# Altium project SPT3G_LCBoard_Rev3.PrjPcb
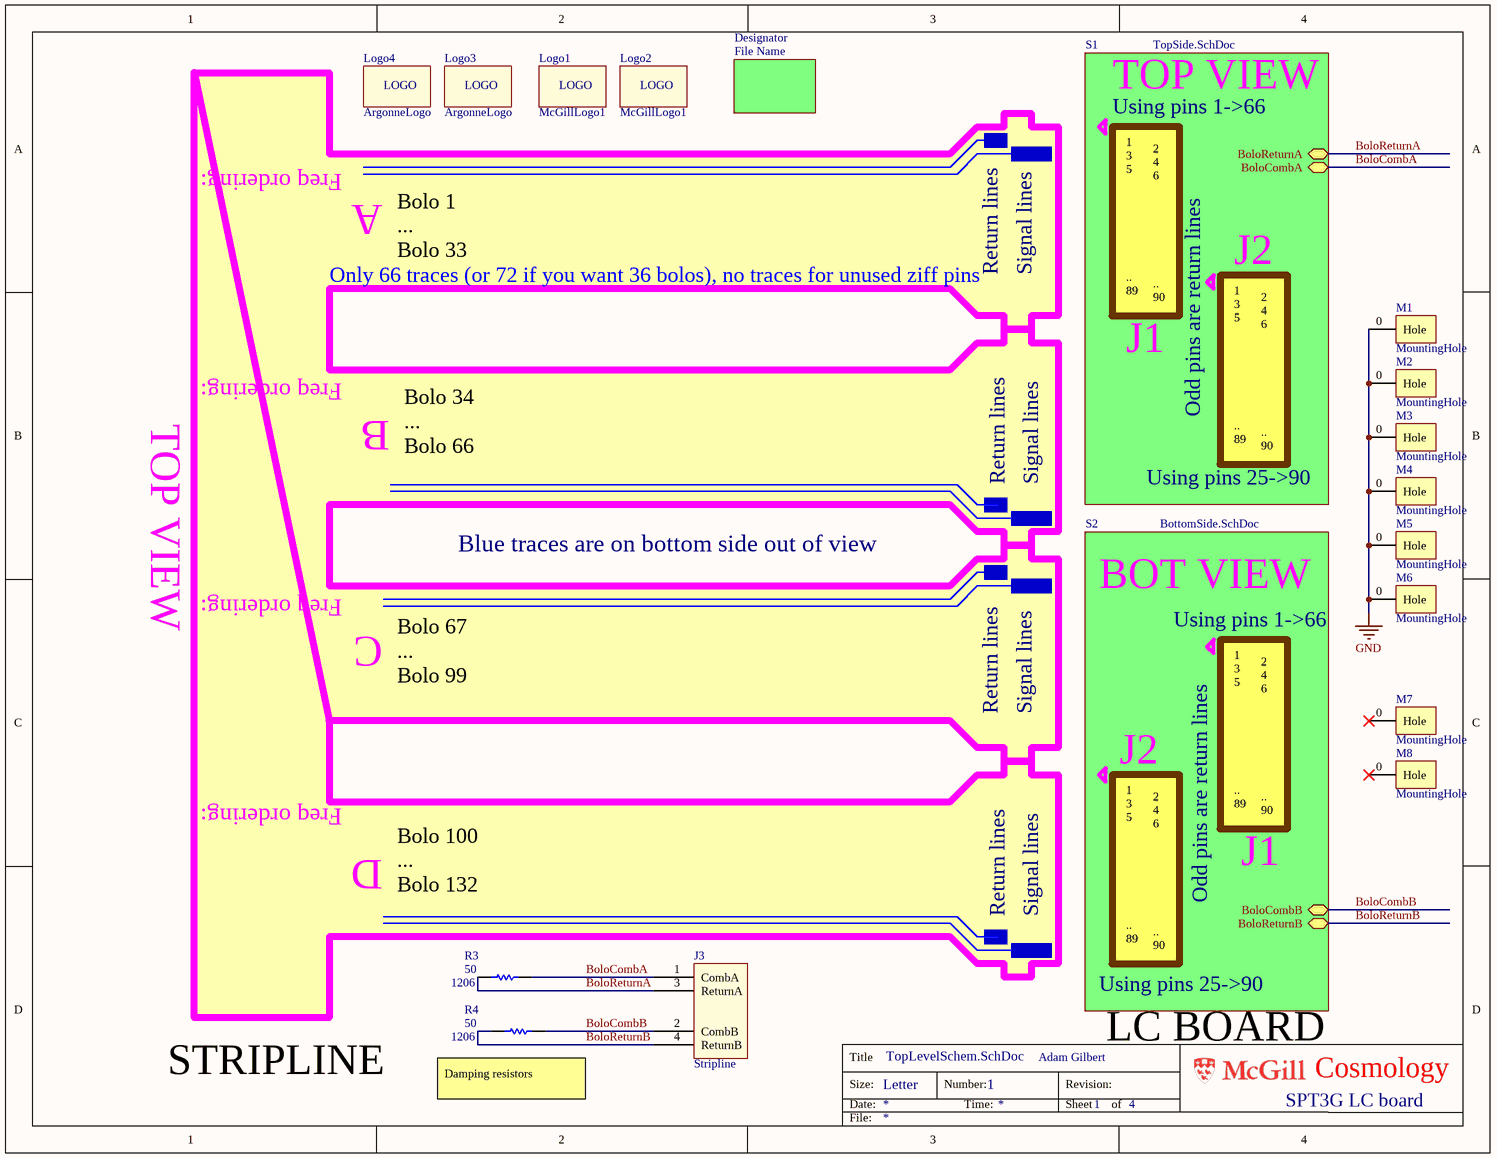
[diagram p0: TopLevelSchem.SchDoc]
DrawnBy: Adam Gilbert & Amy Bender; ProjectTitle: SPT3G LC board
4 sheets, 25 parts. Net scope: hierarchical (ports join the sheet entries above them; power ports are global).
Board file: SPT3G_LCBoardRev3.PcbDoc
Sheets:
  TopLevelSchem.SchDoc
    S1 = TopSide.SchDoc
      A = LCs.SchDoc
    S2 = BottomSide.SchDoc
      B = LCs.SchDoc

## Sheet TopLevelSchem.SchDoc
size Letter; DrawnBy: Adam Gilbert; Organization: Altium Limited; Address1: L3, 12a Rodborough Rd; Address2: Frenchs Forest; Address3: NSW; Address4: Australia 2086; DocumentNumber: 1; SheetNumber: 1; SheetTotal: 4

### Parts
J3  Stripline  [StriplineConnection]
Logo1  McGillLogo1  [McGillLogo1]  (no BOM)
Logo2  McGillLogo1  [McGillLogo1]  (no BOM)
Logo3  ArgonneLogo  [ArgonneLogo]  (no BOM)
Logo4  ArgonneLogo  [ArgonneLogo]  (no BOM)
M1  MountingHole  [MountingHole]  (no BOM)
M2  MountingHole  [MountingHole]  (no BOM)
M3  MountingHole  [MountingHole]  (no BOM)
M4  MountingHole  [MountingHole]  (no BOM)
M5  MountingHole  [MountingHole]  (no BOM)
M6  MountingHole  [MountingHole]  (no BOM)
M7  MountingHole  [MountingHole]  (no BOM)
M8  MountingHole  [MountingHole]  (no BOM)
R3  50  [1206]
R4  50  [1206]

### Sub-sheets
Designator = File Name (file not in this document): no entries
S1 = TopSide.SchDoc: BoloReturnA, BoloCombA
S2 = BottomSide.SchDoc: BoloCombB, BoloReturnB

### Nets
GND: M1.0(Hole) M2.0(Hole) M3.0(Hole) M4.0(Hole) M5.0(Hole) M6.0(Hole)
BoloCombA: J3.1(CombA) R3.1 ; sheet S1/BoloCombA
BoloCombB: J3.2(CombB) R4.1 ; sheet S2/BoloCombB
BoloReturnA: J3.3(ReturnA) R3.2 ; sheet S1/BoloReturnA  [project net BoloReturn]
BoloReturnB: J3.4(ReturnB) R4.2 ; sheet S2/BoloReturnB  [project net BoloReturn]

Not connected (* = marked no-connect by the designer): M7 0(Hole)*; M8 0(Hole)*

### Notes on the sheet
- TOP VIEW
- Freq ordering:
- Using pins 1->66
- A
- Only 66 traces (or 72 if you want 36 bolos), no traces for unused ziff pins
- Bolo 1
  ...
  Bolo 33
- Return lines
- Signal lines
- J2
- 1
  3
  5
  ..
  89
- J1
- 2
  4
  6
  ..
  90
- B
- Odd pins are return lines
- Bolo 34
  ...
  Bolo 66
- Using pins 25->90
- Blue traces are on bottom side out of view
- C
- BOT VIEW
- (near M6) Using pins 1->66
- Bolo 67
  ...
  Bolo 99
- D
- Bolo 100
  ...
  Bolo 132
- LC BOARD
- STRIPLINE
- (near R4) Damping resistors
- Title
- Size:
- Date:
- Letter
- Number:
- Time:
- Revision:
- Sheet
- of
- Cosmology
- File:
- (in symbol Logo) LOGO

### Library data of the parts
J3 = Stripline4wire
Logo1-Logo4 = Logo
R3 R4 = Res1206: Resistor; Param1: 100ppm/C; Param: 1%; TechInfo: *; Value: 50

## Sheet TopSide.SchDoc
size Letter; DrawnBy: Adam Gilbert; Organization: Altium Limited; Address1: L3, 12a Rodborough Rd; Address2: Frenchs Forest; Address3: NSW; Address4: Australia 2086; DocumentNumber: 2; SheetNumber: 2; SheetTotal: 4
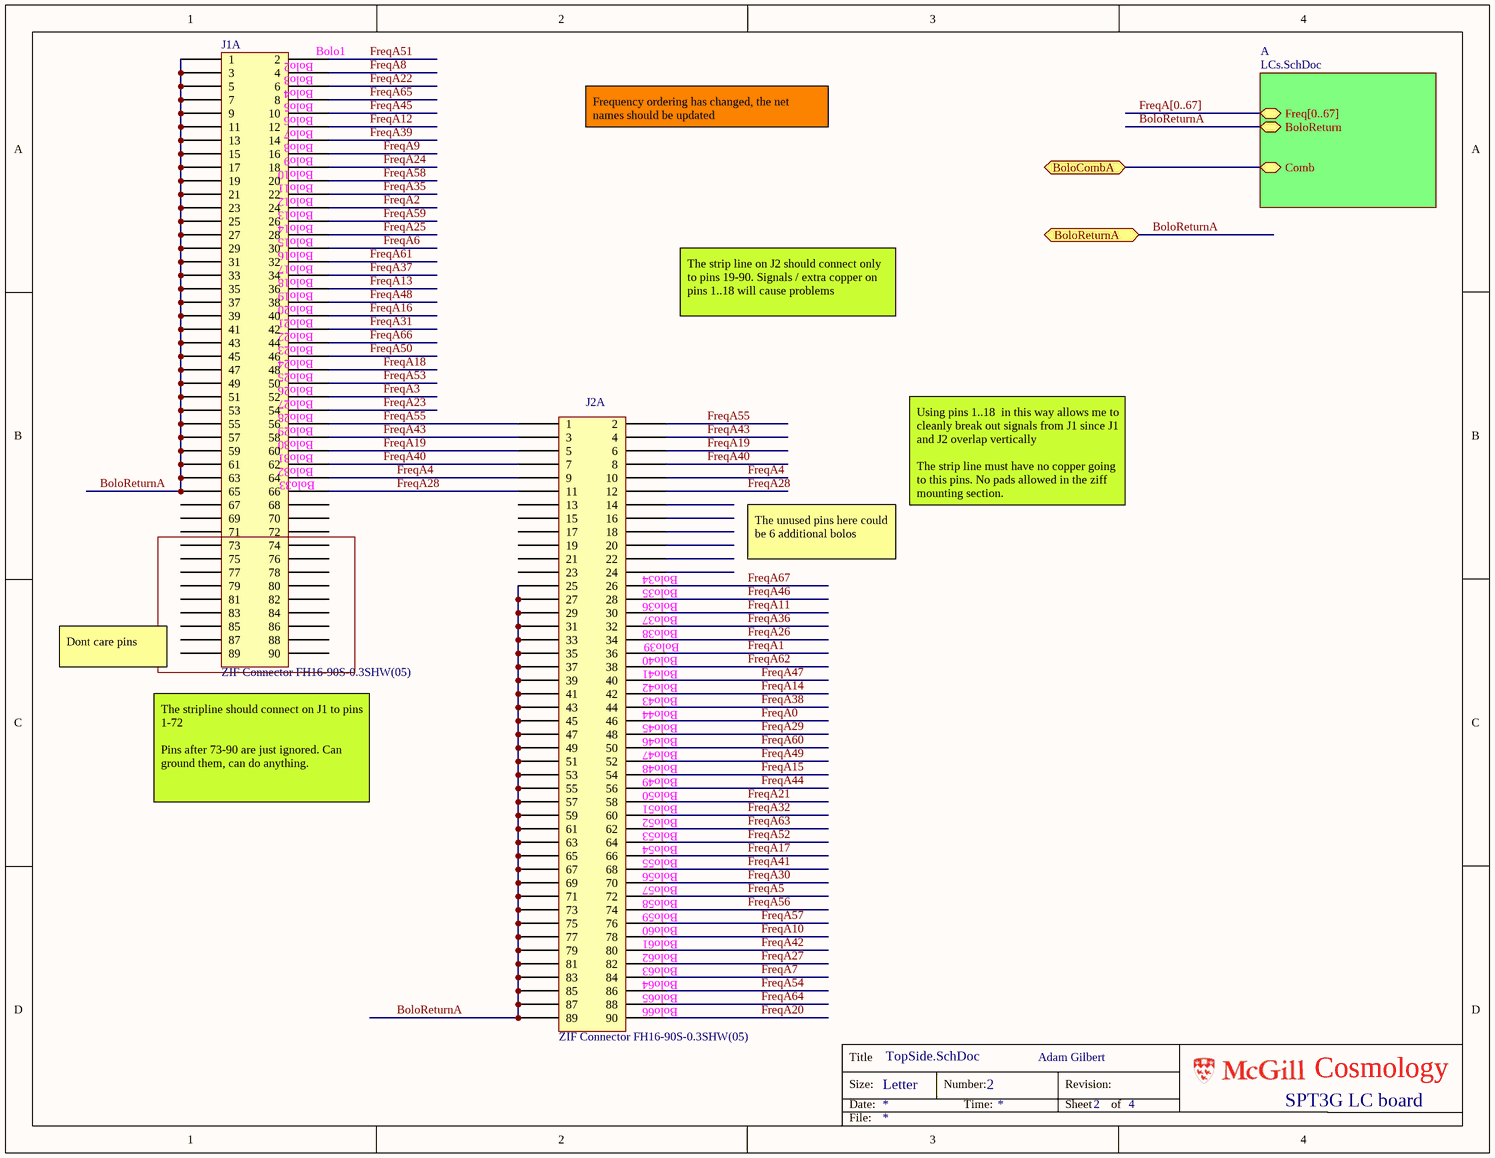
[diagram p1: TopSide.SchDoc]

### Parts
J1A  ZIF Connector FH16-90S-0.3SHW(05)  [LCBoard_ZIFCon]
J2A  ZIF Connector FH16-90S-0.3SHW(05)  [LCBoard_ZIFCon]

### Sub-sheets
A = LCs.SchDoc: Freq[0..67], BoloReturn, Comb

### Ports
BoloCombA, BoloReturnA

### Nets
BoloCombA: port BoloCombA, sheet A/Comb
BoloReturnA: J1A.1 J1A.3 J1A.5 J1A.7 J1A.9 J1A.11 J1A.13 J1A.15 J1A.17 J1A.19 J1A.21 J1A.23 J1A.25 J1A.27 J1A.29 J1A.31 J1A.33 J1A.35 J1A.37 J1A.39 J1A.41 J1A.43 J1A.45 J1A.47 J1A.49 J1A.51 J1A.53 J1A.55 J1A.57 J1A.59 J1A.61 J1A.63 J1A.65 J2A.25 J2A.27 J2A.29 J2A.31 J2A.33 J2A.35 J2A.37 J2A.39 J2A.41 J2A.43 J2A.45 J2A.47 J2A.49 J2A.51 J2A.53 J2A.55 J2A.57 J2A.59 J2A.61 J2A.63 J2A.65 J2A.67 J2A.69 J2A.71 J2A.73 J2A.75 J2A.77 J2A.79 J2A.81 J2A.83 J2A.85 J2A.87 J2A.89 ; port BoloReturnA, sheet A/BoloReturn  [project net BoloReturn]
FreqA0: J2A.46  [project net Freq0]
FreqA1: J2A.36  [project net Freq1]
FreqA2: J1A.24  [project net Freq2]
FreqA3: J1A.52  [project net Freq3]
FreqA4: J1A.64 J2A.9 J2A.10  [project net Freq4]
FreqA5: J2A.72  [project net Freq5]
FreqA6: J1A.30  [project net Freq6]
FreqA7: J2A.84  [project net Freq7]
FreqA8: J1A.4  [project net Freq8]
FreqA9: J1A.16  [project net Freq9]
FreqA10: J2A.78  [project net Freq10]
FreqA11: J2A.30  [project net Freq11]
FreqA12: J1A.12  [project net Freq12]
FreqA13: J1A.36  [project net Freq13]
FreqA14: J2A.42  [project net Freq14]
FreqA15: J2A.54  [project net Freq15]
FreqA16: J1A.40  [project net Freq16]
FreqA17: J2A.66  [project net Freq17]
FreqA18: J1A.48  [project net Freq18]
FreqA19: J1A.60 J2A.5 J2A.6  [project net Freq19]
FreqA20: J2A.90  [project net Freq20]
FreqA21: J2A.58  [project net Freq21]
FreqA22: J1A.6  [project net Freq22]
FreqA23: J1A.54  [project net Freq23]
FreqA24: J1A.18  [project net Freq24]
FreqA25: J1A.28  [project net Freq25]
FreqA26: J2A.34  [project net Freq26]
FreqA27: J2A.82  [project net Freq27]
FreqA28: J1A.66 J2A.11 J2A.12  [project net Freq28]
FreqA29: J2A.48  [project net Freq29]
FreqA30: J2A.70  [project net Freq30]
FreqA31: J1A.42  [project net Freq31]
FreqA32: J2A.60  [project net Freq32]
FreqA35: J1A.22  [project net Freq35]
FreqA36: J2A.32  [project net Freq36]
FreqA37: J1A.34  [project net Freq37]
FreqA38: J2A.44  [project net Freq38]
FreqA39: J1A.14  [project net Freq39]
FreqA40: J1A.62 J2A.7 J2A.8  [project net Freq40]
FreqA41: J2A.68  [project net Freq41]
FreqA42: J2A.80  [project net Freq42]
FreqA43: J1A.58 J2A.3 J2A.4  [project net Freq43]
FreqA44: J2A.56  [project net Freq44]
FreqA45: J1A.10  [project net Freq45]
FreqA46: J2A.28  [project net Freq46]
FreqA47: J2A.40  [project net Freq47]
FreqA48: J1A.38  [project net Freq48]
FreqA49: J2A.52  [project net Freq49]
FreqA50: J1A.46  [project net Freq50]
FreqA51: J1A.2  [project net Freq51]
FreqA52: J2A.64  [project net Freq52]
FreqA53: J1A.50  [project net Freq53]
FreqA54: J2A.86  [project net Freq54]
FreqA55: J1A.56 J2A.1 J2A.2  [project net Freq55]
FreqA56: J2A.74  [project net Freq56]
FreqA57: J2A.76  [project net Freq57]
FreqA58: J1A.20  [project net Freq58]
FreqA59: J1A.26  [project net Freq59]
FreqA60: J2A.50  [project net Freq60]
FreqA61: J1A.32  [project net Freq61]
FreqA62: J2A.38  [project net Freq62]
FreqA63: J2A.62  [project net Freq63]
FreqA64: J2A.88  [project net Freq64]
FreqA65: J1A.8  [project net Freq65]
FreqA66: J1A.44  [project net Freq66]
FreqA67: J2A.26  [project net Freq67]

Not connected (* = marked no-connect by the designer): J1A 67 68 69 70 71 72 73 74 75 76 77 78 79 80 81 82 83 84 85 86 87 88 89 90; J2A 13 14 15 16 17 18 19 20 21 22 23 24

### Buses and harness runs
bus FreqA[0..67] = sheet A/Freq[0..67]

### Notes on the sheet
- (near J1A) Bolo2
- (near J1A) Bolo3
- (near J1A) Bolo4
- (near J1A) Bolo5
- (near J1A) Bolo1
- (near J1A) Bolo6
- (near J1A) Bolo7
- (near J1A) Bolo8
- (near J1A) Bolo9
- (near J1A) Bolo10
- Frequency ordering has changed, the net names should be updated
- (near J1A) Bolo11
- (near J1A) Bolo12
- (near J1A) Bolo13
- (near J1A) Bolo14
- (near J1A) Bolo15
- (near J1A) Bolo16
- (near J1A) Bolo17
- (near J1A) Bolo18
- (near J1A) Bolo19
- (near J1A) Bolo20
- (near J1A) Bolo21
- (near J1A) Bolo22
- (near J1A) Bolo23
- (near J1A) Bolo24
- (near J1A) Bolo25
- The strip line on J2 should connect only to pins 19-90. Signals / extra copper on pins 1..18 will cause problems
- (near J1A) Bolo26
- (near J1A) Bolo27
- (near J1A) Bolo28
- (near J1A) Bolo29
- (near J1A) Bolo30
- (near J1A) Bolo31
- (near J1A) Bolo32
- (near J1A) Bolo33
- Using pins 1..18  in this way allows me to cleanly break out signals from J1 since J1 and J2 overlap vertically
  The strip line must have no copper going to this pins. No pads allowed in the ziff mounting section.
- (near J2A) Bolo34
- The unused pins here could be 6 additional bolos
- (near J2A) Bolo35
- (near J2A) Bolo36
- (near J2A) Bolo37
- (near J2A) Bolo38
- Bolo39
- Dont care pins
- (near J2A) Bolo40
- (near J2A) Bolo41
- (near J2A) Bolo42
- (near J2A) Bolo43
- (near J2A) Bolo44
- (near J2A) Bolo45
- (near J2A) Bolo46
- (near J2A) Bolo47
- (near J2A) Bolo48
- (near J2A) Bolo49
- (near J1A) The stripline should connect on J1 to pins 1-72
  Pins after 73-90 are just ignored. Can ground them, can do anything.
- (near J2A) Bolo50
- (near J2A) Bolo51
- (near J2A) Bolo52
- (near J2A) Bolo53
- (near J2A) Bolo54
- (near J2A) Bolo55
- (near J2A) Bolo56
- (near J2A) Bolo57
- (near J2A) Bolo58
- (near J2A) Bolo59
- (near J2A) Bolo60
- (near J2A) Bolo61
- (near J2A) Bolo62
- (near J2A) Bolo63
- (near J2A) Bolo64
- (near J2A) Bolo65
- (near J2A) Bolo66
- Title
- Size:
- Date:
- Letter
- Number:
- Time:
- Revision:
- Sheet
- of
- Cosmology
- File:

### Library data of the parts
J1A J2A = LCboard_FH16-90S-0.3SHW(05)

## Sheet LCs.SchDoc
size Letter; DrawnBy: Adam Gilbert; Organization: Altium Limited; Address1: L3, 12a Rodborough Rd; Address2: Frenchs Forest; Address3: NSW; Address4: Australia 2086; DocumentNumber: 4; SheetNumber: 4; SheetTotal: 4
Used 2 times, as channels S1/A, S2/B. Parts and nets are listed once, with the designators drawn on the sheet.
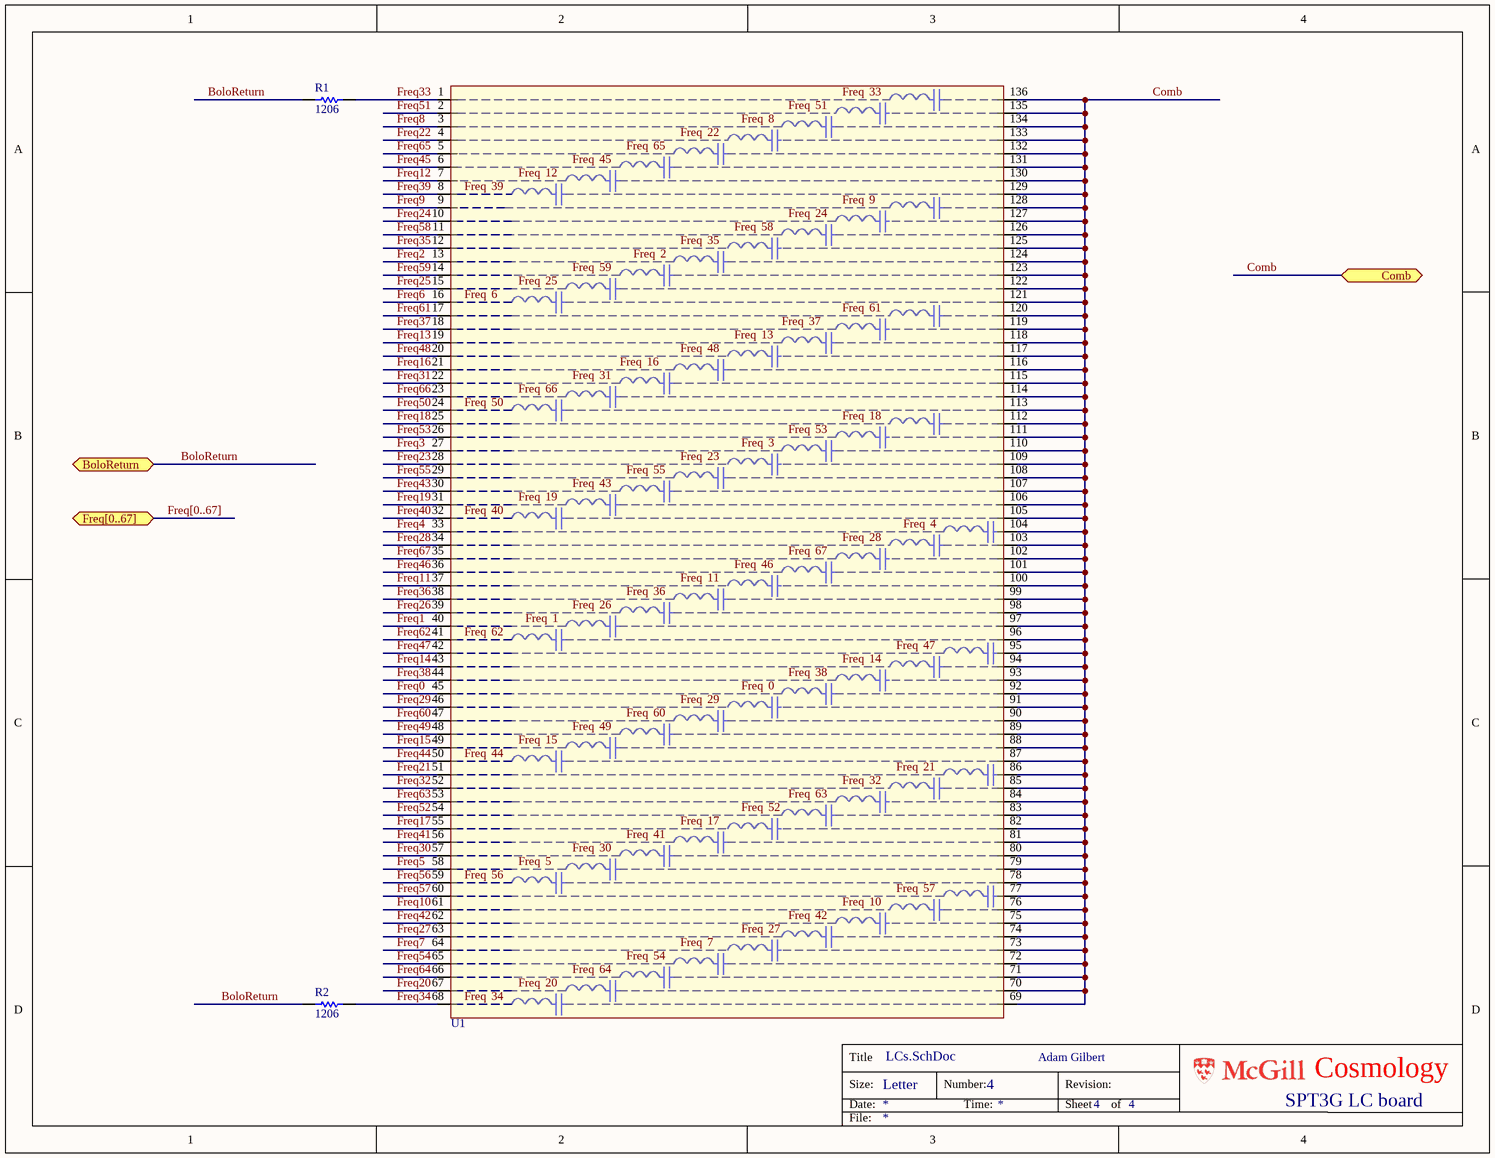
[diagram p2: LCs.SchDoc]

### Parts
R1  Res1206  [1206]  (value not drawn)
R2  Res1206  [1206]  (value not drawn)
U1  LC68_wafer  [68xLC]  (value not drawn)  (no BOM)

### Ports
BoloReturn, Comb, Freq[0..67]

### Nets
BoloReturn: R1.1 R2.1 ; port BoloReturn
Comb: U1.69 U1.70 U1.71 U1.72 U1.73 U1.74 U1.75 U1.76 U1.77 U1.78 U1.79 U1.80 U1.81 U1.82 U1.83 U1.84 U1.85 U1.86 U1.87 U1.88 U1.89 U1.90 U1.91 U1.92 U1.93 U1.94 U1.95 U1.96 U1.97 U1.98 U1.99 U1.100 U1.101 U1.102 U1.103 U1.104 U1.105 U1.106 U1.107 U1.108 U1.109 U1.110 U1.111 U1.112 U1.113 U1.114 U1.115 U1.116 U1.117 U1.118 U1.119 U1.120 U1.121 U1.122 U1.123 U1.124 U1.125 U1.126 U1.127 U1.128 U1.129 U1.130 U1.131 U1.132 U1.133 U1.134 U1.135 U1.136 ; port Comb
Freq0: U1.45
Freq1: U1.40
Freq2: U1.13
Freq3: U1.27
Freq4: U1.33
Freq5: U1.58
Freq6: U1.16
Freq7: U1.64
Freq8: U1.3
Freq9: U1.9
Freq10: U1.61
Freq11: U1.37
Freq12: U1.7
Freq13: U1.19
Freq14: U1.43
Freq15: U1.49
Freq16: U1.21
Freq17: U1.55
Freq18: U1.25
Freq19: U1.31
Freq20: U1.67
Freq21: U1.51
Freq22: U1.4
Freq23: U1.28
Freq24: U1.10
Freq25: U1.15
Freq26: U1.39
Freq27: U1.63
Freq28: U1.34
Freq29: U1.46
Freq30: U1.57
Freq31: U1.22
Freq32: U1.52
Freq33: R1.2 U1.1
Freq34: R2.2 U1.68
Freq35: U1.12
Freq36: U1.38
Freq37: U1.18
Freq38: U1.44
Freq39: U1.8
Freq40: U1.32
Freq41: U1.56
Freq42: U1.62
Freq43: U1.30
Freq44: U1.50
Freq45: U1.6
Freq46: U1.36
Freq47: U1.42
Freq48: U1.20
Freq49: U1.48
Freq50: U1.24
Freq51: U1.2
Freq52: U1.54
Freq53: U1.26
Freq54: U1.65
Freq55: U1.29
Freq56: U1.59
Freq57: U1.60
Freq58: U1.11
Freq59: U1.14
Freq60: U1.47
Freq61: U1.17
Freq62: U1.41
Freq63: U1.53
Freq64: U1.66
Freq65: U1.5
Freq66: U1.23
Freq67: U1.35

### Channels
S1/A: designators end in _A; ports BoloReturn=BoloReturn Comb=BoloCombA
S2/B: designators end in _B; ports BoloReturn=BoloReturn Comb=BoloCombB

### Buses and harness runs
bus Freq[0..67] = port Freq[0..67]

### Notes on the sheet
- Title
- Size:
- Date:
- Letter
- Number:
- Time:
- Revision:
- Sheet
- of
- Cosmology
- File:
- (in symbol LC68Wafer) Freq; 0

### Library data of the parts
R1 R2 = Res1206: Resistor; Param1: 100ppm/C; Value: DNL; Param: 1%; TechInfo: *
U1 = LC68Wafer: Gold bonded integrated LC

## Sheet BottomSide.SchDoc
size Letter; DrawnBy: Adam Gilbert; Organization: Altium Limited; Address1: L3, 12a Rodborough Rd; Address2: Frenchs Forest; Address3: NSW; Address4: Australia 2086; DocumentNumber: 3; SheetNumber: 3; SheetTotal: 4
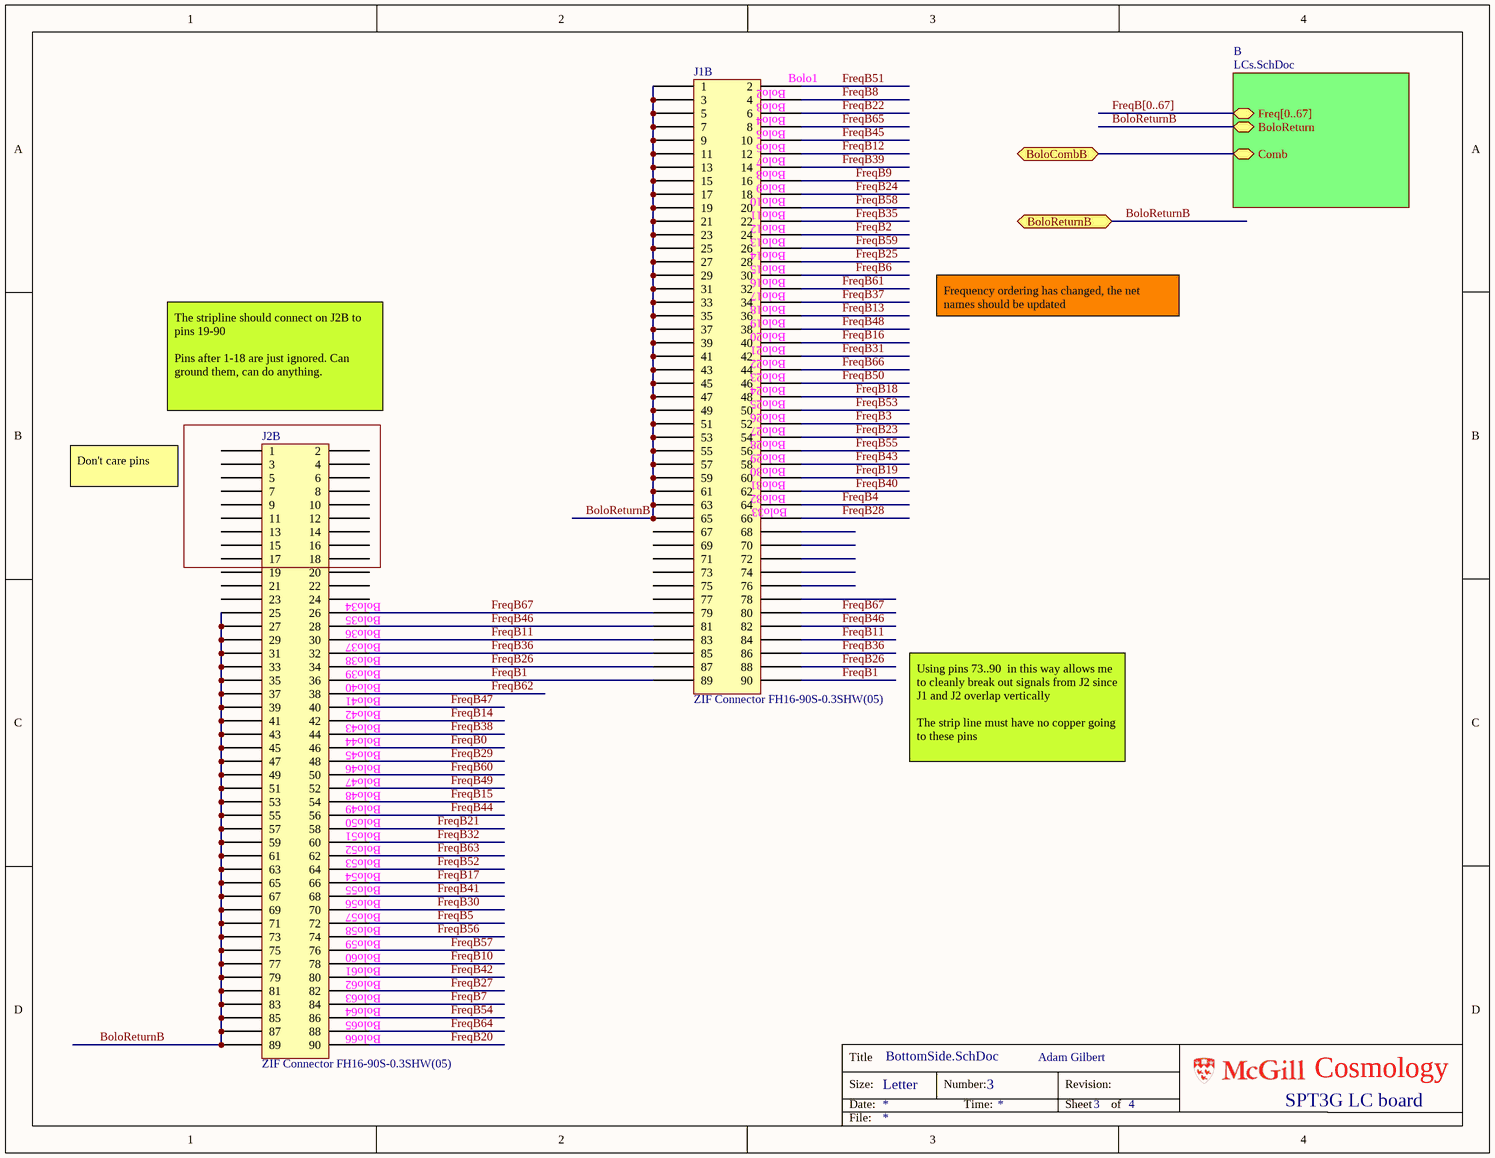
[diagram p3: BottomSide.SchDoc]

### Parts
J1B  ZIF Connector FH16-90S-0.3SHW(05)  [LCBoard_ZIFCon]
J2B  ZIF Connector FH16-90S-0.3SHW(05)  [LCBoard_ZIFCon]

### Sub-sheets
B = LCs.SchDoc: Freq[0..67], BoloReturn, Comb

### Ports
BoloCombB, BoloReturnB

### Nets
BoloCombB: port BoloCombB, sheet B/Comb
BoloReturnB: J1B.1 J1B.3 J1B.5 J1B.7 J1B.9 J1B.11 J1B.13 J1B.15 J1B.17 J1B.19 J1B.21 J1B.23 J1B.25 J1B.27 J1B.29 J1B.31 J1B.33 J1B.35 J1B.37 J1B.39 J1B.41 J1B.43 J1B.45 J1B.47 J1B.49 J1B.51 J1B.53 J1B.55 J1B.57 J1B.59 J1B.61 J1B.63 J1B.65 J2B.25 J2B.27 J2B.29 J2B.31 J2B.33 J2B.35 J2B.37 J2B.39 J2B.41 J2B.43 J2B.45 J2B.47 J2B.49 J2B.51 J2B.53 J2B.55 J2B.57 J2B.59 J2B.61 J2B.63 J2B.65 J2B.67 J2B.69 J2B.71 J2B.73 J2B.75 J2B.77 J2B.79 J2B.81 J2B.83 J2B.85 J2B.87 J2B.89 ; port BoloReturnB, sheet B/BoloReturn  [project net BoloReturn]
FreqB0: J2B.46  [project net Freq0]
FreqB1: J1B.89 J1B.90 J2B.36  [project net Freq1]
FreqB2: J1B.24  [project net Freq2]
FreqB3: J1B.52  [project net Freq3]
FreqB4: J1B.64  [project net Freq4]
FreqB5: J2B.72  [project net Freq5]
FreqB6: J1B.30  [project net Freq6]
FreqB7: J2B.84  [project net Freq7]
FreqB8: J1B.4  [project net Freq8]
FreqB9: J1B.16  [project net Freq9]
FreqB10: J2B.78  [project net Freq10]
FreqB11: J1B.83 J1B.84 J2B.30  [project net Freq11]
FreqB12: J1B.12  [project net Freq12]
FreqB13: J1B.36  [project net Freq13]
FreqB14: J2B.42  [project net Freq14]
FreqB15: J2B.54  [project net Freq15]
FreqB16: J1B.40  [project net Freq16]
FreqB17: J2B.66  [project net Freq17]
FreqB18: J1B.48  [project net Freq18]
FreqB19: J1B.60  [project net Freq19]
FreqB20: J2B.90  [project net Freq20]
FreqB21: J2B.58  [project net Freq21]
FreqB22: J1B.6  [project net Freq22]
FreqB23: J1B.54  [project net Freq23]
FreqB24: J1B.18  [project net Freq24]
FreqB25: J1B.28  [project net Freq25]
FreqB26: J1B.87 J1B.88 J2B.34  [project net Freq26]
FreqB27: J2B.82  [project net Freq27]
FreqB28: J1B.66  [project net Freq28]
FreqB29: J2B.48  [project net Freq29]
FreqB30: J2B.70  [project net Freq30]
FreqB31: J1B.42  [project net Freq31]
FreqB32: J2B.60  [project net Freq32]
FreqB35: J1B.22  [project net Freq35]
FreqB36: J1B.85 J1B.86 J2B.32  [project net Freq36]
FreqB37: J1B.34  [project net Freq37]
FreqB38: J2B.44  [project net Freq38]
FreqB39: J1B.14  [project net Freq39]
FreqB40: J1B.62  [project net Freq40]
FreqB41: J2B.68  [project net Freq41]
FreqB42: J2B.80  [project net Freq42]
FreqB43: J1B.58  [project net Freq43]
FreqB44: J2B.56  [project net Freq44]
FreqB45: J1B.10  [project net Freq45]
FreqB46: J1B.81 J1B.82 J2B.28  [project net Freq46]
FreqB47: J2B.40  [project net Freq47]
FreqB48: J1B.38  [project net Freq48]
FreqB49: J2B.52  [project net Freq49]
FreqB50: J1B.46  [project net Freq50]
FreqB51: J1B.2  [project net Freq51]
FreqB52: J2B.64  [project net Freq52]
FreqB53: J1B.50  [project net Freq53]
FreqB54: J2B.86  [project net Freq54]
FreqB55: J1B.56  [project net Freq55]
FreqB56: J2B.74  [project net Freq56]
FreqB57: J2B.76  [project net Freq57]
FreqB58: J1B.20  [project net Freq58]
FreqB59: J1B.26  [project net Freq59]
FreqB60: J2B.50  [project net Freq60]
FreqB61: J1B.32  [project net Freq61]
FreqB62: J2B.38  [project net Freq62]
FreqB63: J2B.62  [project net Freq63]
FreqB64: J2B.88  [project net Freq64]
FreqB65: J1B.8  [project net Freq65]
FreqB66: J1B.44  [project net Freq66]
FreqB67: J1B.79 J1B.80 J2B.26  [project net Freq67]

Not connected (* = marked no-connect by the designer): J1B 67 68 69 70 71 72 73 74 75 76 77 78; J2B 1 2 3 4 5 6 7 8 9 10 11 12 13 14 15 16 17 18 19 20 21 22 23 24

### Buses and harness runs
bus FreqB[0..67] = sheet B/Freq[0..67]

### Notes on the sheet
- (near J1B) Bolo2
- (near J1B) Bolo3
- (near J1B) Bolo1
- (near J1B) Bolo4
- (near J1B) Bolo5
- (near J1B) Bolo6
- (near J1B) Bolo7
- (near J1B) Bolo8
- (near J1B) Bolo9
- (near J1B) Bolo10
- (near J1B) Bolo11
- (near J1B) Bolo12
- (near J1B) Bolo13
- (near J1B) Bolo14
- (near J1B) Bolo15
- (near J1B) Bolo16
- (near J1B) Bolo17
- (near J1B) Bolo18
- (near J1B) Bolo19
- (near J1B) Bolo20
- (near J1B) Bolo21
- (near J1B) Bolo22
- (near J1B) Bolo23
- Frequency ordering has changed, the net names should be updated
- (near J2B) The stripline should connect on J2B to pins 19-90
  Pins after 1-18 are just ignored. Can ground them, can do anything.
- (near J1B) Bolo24
- (near J1B) Bolo25
- (near J1B) Bolo26
- (near J1B) Bolo27
- (near J1B) Bolo28
- Don't care pins
- (near J1B) Bolo29
- (near J1B) Bolo30
- (near J1B) Bolo31
- (near J1B) Bolo32
- (near J1B) Bolo33
- (near J2B) Bolo34
- (near J2B) Bolo35
- (near J2B) Bolo36
- (near J2B) Bolo37
- (near J2B) Bolo38
- (near J2B) Bolo39
- (near J2B) Bolo40
- (near J2B) Bolo41
- (near J2B) Bolo42
- (near J2B) Bolo43
- (near J2B) Bolo44
- (near J2B) Bolo45
- (near J2B) Bolo46
- (near J2B) Bolo47
- Using pins 73..90  in this way allows me to cleanly break out signals from J2 since J1 and J2 overlap vertically
  The strip line must have no copper going to these pins
- (near J2B) Bolo48
- (near J2B) Bolo49
- (near J2B) Bolo50
- (near J2B) Bolo51
- (near J2B) Bolo52
- (near J2B) Bolo53
- (near J2B) Bolo54
- (near J2B) Bolo55
- (near J2B) Bolo56
- (near J2B) Bolo57
- (near J2B) Bolo58
- (near J2B) Bolo59
- (near J2B) Bolo60
- (near J2B) Bolo61
- (near J2B) Bolo62
- (near J2B) Bolo63
- (near J2B) Bolo64
- (near J2B) Bolo65
- (near J2B) Bolo66
- Title
- Size:
- Date:
- Letter
- Number:
- Time:
- Revision:
- Sheet
- of
- Cosmology
- File:

### Library data of the parts
J1B J2B = LCboard_FH16-90S-0.3SHW(05)

## Nets that join several sheets
BoloCombA: TopLevelSchem (J3.1 R3.1), S1/A (68 pins)
BoloCombB: TopLevelSchem (J3.2 R4.1), S2/B (68 pins)
BoloReturn: TopLevelSchem (J3.3 R3.2), TopSide (66 pins), S1/A (R1_A.1 R2_A.1)
BoloReturn: TopLevelSchem (J3.4 R4.2), BottomSide (66 pins), S2/B (R1_B.1 R2_B.1)
Freq0: TopSide (J2A.46), S1/A (U1_A.45)
Freq0: BottomSide (J2B.46), S2/B (U1_B.45)
Freq1: TopSide (J2A.36), S1/A (U1_A.40)
Freq1: BottomSide (J1B.89 J1B.90 J2B.36), S2/B (U1_B.40)
Freq2: TopSide (J1A.24), S1/A (U1_A.13)
Freq2: BottomSide (J1B.24), S2/B (U1_B.13)
Freq3: TopSide (J1A.52), S1/A (U1_A.27)
Freq3: BottomSide (J1B.52), S2/B (U1_B.27)
Freq4: TopSide (J1A.64 J2A.9 J2A.10), S1/A (U1_A.33)
Freq4: BottomSide (J1B.64), S2/B (U1_B.33)
Freq5: TopSide (J2A.72), S1/A (U1_A.58)
Freq5: BottomSide (J2B.72), S2/B (U1_B.58)
Freq6: TopSide (J1A.30), S1/A (U1_A.16)
Freq6: BottomSide (J1B.30), S2/B (U1_B.16)
Freq7: TopSide (J2A.84), S1/A (U1_A.64)
Freq7: BottomSide (J2B.84), S2/B (U1_B.64)
Freq8: TopSide (J1A.4), S1/A (U1_A.3)
Freq8: BottomSide (J1B.4), S2/B (U1_B.3)
Freq9: TopSide (J1A.16), S1/A (U1_A.9)
Freq9: BottomSide (J1B.16), S2/B (U1_B.9)
Freq10: TopSide (J2A.78), S1/A (U1_A.61)
Freq10: BottomSide (J2B.78), S2/B (U1_B.61)
Freq11: TopSide (J2A.30), S1/A (U1_A.37)
Freq11: BottomSide (J1B.83 J1B.84 J2B.30), S2/B (U1_B.37)
Freq12: TopSide (J1A.12), S1/A (U1_A.7)
Freq12: BottomSide (J1B.12), S2/B (U1_B.7)
Freq13: TopSide (J1A.36), S1/A (U1_A.19)
Freq13: BottomSide (J1B.36), S2/B (U1_B.19)
Freq14: TopSide (J2A.42), S1/A (U1_A.43)
Freq14: BottomSide (J2B.42), S2/B (U1_B.43)
Freq15: TopSide (J2A.54), S1/A (U1_A.49)
Freq15: BottomSide (J2B.54), S2/B (U1_B.49)
Freq16: TopSide (J1A.40), S1/A (U1_A.21)
Freq16: BottomSide (J1B.40), S2/B (U1_B.21)
Freq17: TopSide (J2A.66), S1/A (U1_A.55)
Freq17: BottomSide (J2B.66), S2/B (U1_B.55)
Freq18: TopSide (J1A.48), S1/A (U1_A.25)
Freq18: BottomSide (J1B.48), S2/B (U1_B.25)
Freq19: TopSide (J1A.60 J2A.5 J2A.6), S1/A (U1_A.31)
Freq19: BottomSide (J1B.60), S2/B (U1_B.31)
Freq20: TopSide (J2A.90), S1/A (U1_A.67)
Freq20: BottomSide (J2B.90), S2/B (U1_B.67)
Freq21: TopSide (J2A.58), S1/A (U1_A.51)
Freq21: BottomSide (J2B.58), S2/B (U1_B.51)
Freq22: TopSide (J1A.6), S1/A (U1_A.4)
Freq22: BottomSide (J1B.6), S2/B (U1_B.4)
Freq23: TopSide (J1A.54), S1/A (U1_A.28)
Freq23: BottomSide (J1B.54), S2/B (U1_B.28)
Freq24: TopSide (J1A.18), S1/A (U1_A.10)
Freq24: BottomSide (J1B.18), S2/B (U1_B.10)
Freq25: TopSide (J1A.28), S1/A (U1_A.15)
Freq25: BottomSide (J1B.28), S2/B (U1_B.15)
Freq26: TopSide (J2A.34), S1/A (U1_A.39)
Freq26: BottomSide (J1B.87 J1B.88 J2B.34), S2/B (U1_B.39)
Freq27: TopSide (J2A.82), S1/A (U1_A.63)
Freq27: BottomSide (J2B.82), S2/B (U1_B.63)
Freq28: TopSide (J1A.66 J2A.11 J2A.12), S1/A (U1_A.34)
Freq28: BottomSide (J1B.66), S2/B (U1_B.34)
Freq29: TopSide (J2A.48), S1/A (U1_A.46)
Freq29: BottomSide (J2B.48), S2/B (U1_B.46)
Freq30: TopSide (J2A.70), S1/A (U1_A.57)
Freq30: BottomSide (J2B.70), S2/B (U1_B.57)
Freq31: TopSide (J1A.42), S1/A (U1_A.22)
Freq31: BottomSide (J1B.42), S2/B (U1_B.22)
Freq32: TopSide (J2A.60), S1/A (U1_A.52)
Freq32: BottomSide (J2B.60), S2/B (U1_B.52)
Freq35: TopSide (J1A.22), S1/A (U1_A.12)
Freq35: BottomSide (J1B.22), S2/B (U1_B.12)
Freq36: TopSide (J2A.32), S1/A (U1_A.38)
Freq36: BottomSide (J1B.85 J1B.86 J2B.32), S2/B (U1_B.38)
Freq37: TopSide (J1A.34), S1/A (U1_A.18)
Freq37: BottomSide (J1B.34), S2/B (U1_B.18)
Freq38: TopSide (J2A.44), S1/A (U1_A.44)
Freq38: BottomSide (J2B.44), S2/B (U1_B.44)
Freq39: TopSide (J1A.14), S1/A (U1_A.8)
Freq39: BottomSide (J1B.14), S2/B (U1_B.8)
Freq40: TopSide (J1A.62 J2A.7 J2A.8), S1/A (U1_A.32)
Freq40: BottomSide (J1B.62), S2/B (U1_B.32)
Freq41: TopSide (J2A.68), S1/A (U1_A.56)
Freq41: BottomSide (J2B.68), S2/B (U1_B.56)
Freq42: TopSide (J2A.80), S1/A (U1_A.62)
Freq42: BottomSide (J2B.80), S2/B (U1_B.62)
Freq43: TopSide (J1A.58 J2A.3 J2A.4), S1/A (U1_A.30)
Freq43: BottomSide (J1B.58), S2/B (U1_B.30)
Freq44: TopSide (J2A.56), S1/A (U1_A.50)
Freq44: BottomSide (J2B.56), S2/B (U1_B.50)
Freq45: TopSide (J1A.10), S1/A (U1_A.6)
Freq45: BottomSide (J1B.10), S2/B (U1_B.6)
Freq46: TopSide (J2A.28), S1/A (U1_A.36)
Freq46: BottomSide (J1B.81 J1B.82 J2B.28), S2/B (U1_B.36)
Freq47: TopSide (J2A.40), S1/A (U1_A.42)
Freq47: BottomSide (J2B.40), S2/B (U1_B.42)
Freq48: TopSide (J1A.38), S1/A (U1_A.20)
Freq48: BottomSide (J1B.38), S2/B (U1_B.20)
Freq49: TopSide (J2A.52), S1/A (U1_A.48)
Freq49: BottomSide (J2B.52), S2/B (U1_B.48)
Freq50: TopSide (J1A.46), S1/A (U1_A.24)
Freq50: BottomSide (J1B.46), S2/B (U1_B.24)
Freq51: TopSide (J1A.2), S1/A (U1_A.2)
Freq51: BottomSide (J1B.2), S2/B (U1_B.2)
Freq52: TopSide (J2A.64), S1/A (U1_A.54)
Freq52: BottomSide (J2B.64), S2/B (U1_B.54)
Freq53: TopSide (J1A.50), S1/A (U1_A.26)
Freq53: BottomSide (J1B.50), S2/B (U1_B.26)
Freq54: TopSide (J2A.86), S1/A (U1_A.65)
Freq54: BottomSide (J2B.86), S2/B (U1_B.65)
Freq55: TopSide (J1A.56 J2A.1 J2A.2), S1/A (U1_A.29)
Freq55: BottomSide (J1B.56), S2/B (U1_B.29)
Freq56: TopSide (J2A.74), S1/A (U1_A.59)
Freq56: BottomSide (J2B.74), S2/B (U1_B.59)
Freq57: TopSide (J2A.76), S1/A (U1_A.60)
Freq57: BottomSide (J2B.76), S2/B (U1_B.60)
Freq58: TopSide (J1A.20), S1/A (U1_A.11)
Freq58: BottomSide (J1B.20), S2/B (U1_B.11)
Freq59: TopSide (J1A.26), S1/A (U1_A.14)
Freq59: BottomSide (J1B.26), S2/B (U1_B.14)
Freq60: TopSide (J2A.50), S1/A (U1_A.47)
Freq60: BottomSide (J2B.50), S2/B (U1_B.47)
Freq61: TopSide (J1A.32), S1/A (U1_A.17)
Freq61: BottomSide (J1B.32), S2/B (U1_B.17)
Freq62: TopSide (J2A.38), S1/A (U1_A.41)
Freq62: BottomSide (J2B.38), S2/B (U1_B.41)
Freq63: TopSide (J2A.62), S1/A (U1_A.53)
Freq63: BottomSide (J2B.62), S2/B (U1_B.53)
Freq64: TopSide (J2A.88), S1/A (U1_A.66)
Freq64: BottomSide (J2B.88), S2/B (U1_B.66)
Freq65: TopSide (J1A.8), S1/A (U1_A.5)
Freq65: BottomSide (J1B.8), S2/B (U1_B.5)
Freq66: TopSide (J1A.44), S1/A (U1_A.23)
Freq66: BottomSide (J1B.44), S2/B (U1_B.23)
Freq67: TopSide (J2A.26), S1/A (U1_A.35)
Freq67: BottomSide (J1B.79 J1B.80 J2B.26), S2/B (U1_B.35)